# Altium schematic sheet Connector.SchDoc
size A4
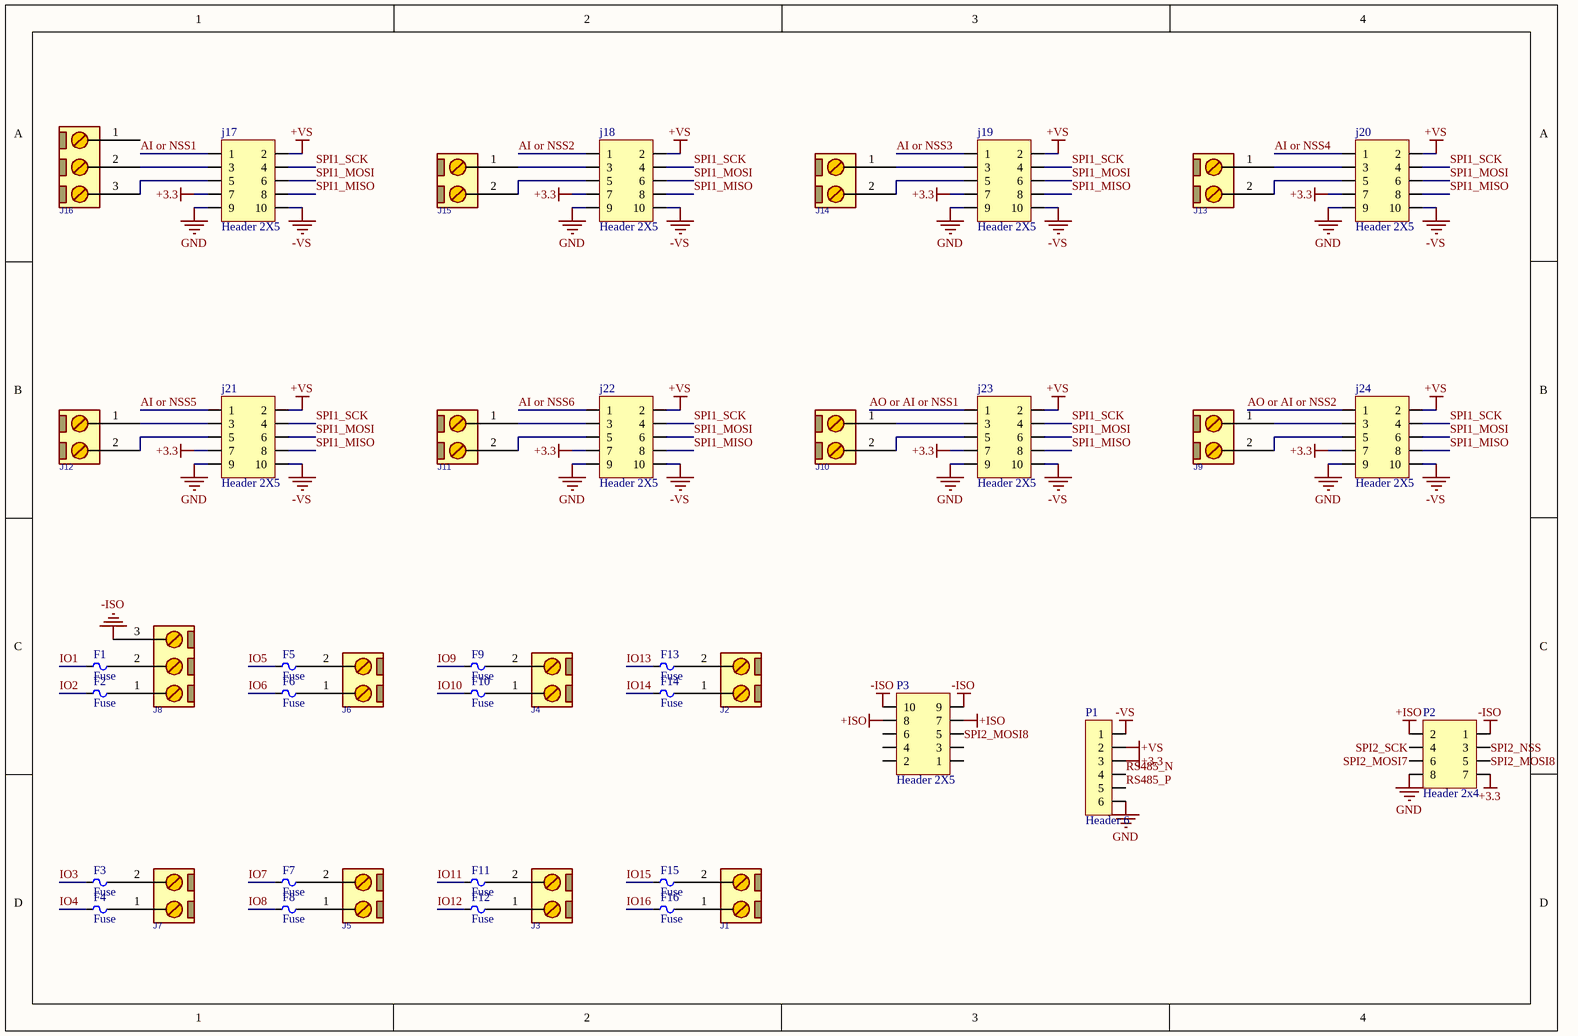
[diagram p0: Connector.SchDoc]

## Parts
F1  Fuse  [Fuse 0805]
F2  Fuse  [Fuse 0805]
F3  Fuse  [Fuse 0805]
F4  Fuse  [Fuse 0805]
F5  Fuse  [Fuse 0805]
F6  Fuse  [Fuse 0805]
F7  Fuse  [Fuse 0805]
F8  Fuse  [Fuse 0805]
F9  Fuse  [Fuse 0805]
F10  Fuse  [Fuse 0805]
F11  Fuse  [Fuse 0805]
F12  Fuse  [Fuse 0805]
F13  Fuse  [Fuse 0805]
F14  Fuse  [Fuse 0805]
F15  Fuse  [Fuse 0805]
F16  Fuse  [Fuse 0805]
J1  CONN_TB2  [TBG_2]  (value not drawn)
J2  CONN_TB2  [TBG_2]  (value not drawn)
J3  CONN_TB2  [TBG_2]  (value not drawn)
J4  CONN_TB2  [TBG_2]  (value not drawn)
J5  CONN_TB2  [TBG_2]  (value not drawn)
J6  CONN_TB2  [TBG_2]  (value not drawn)
J7  CONN_TB2  [TBG_2]  (value not drawn)
J8  CONN_TB3  [TBG_3]  (value not drawn)
J9  CONN_TB2  [TBG_2]  (value not drawn)
J10  CONN_TB2  [TBG_2]  (value not drawn)
J11  CONN_TB2  [TBG_2]  (value not drawn)
J12  CONN_TB2  [TBG_2]  (value not drawn)
J13  CONN_TB2  [TBG_2]  (value not drawn)
J14  CONN_TB2  [TBG_2]  (value not drawn)
J15  CONN_TB2  [TBG_2]  (value not drawn)
J16  CONN_TB3  [TBG_3]  (value not drawn)
j17  Header 2X5  [HDR2_F_2X5]
j18  Header 2X5  [HDR2_F_2X5]
j19  Header 2X5  [HDR2_F_2X5]
j20  Header 2X5  [HDR2_F_2X5]
j21  Header 2X5  [HDR2_F_2X5]
j22  Header 2X5  [HDR2_F_2X5]
j23  Header 2X5  [HDR2_F_2X5]
j24  Header 2X5  [HDR2_F_2X5]
P1  Header 6  [Header 6]
P2  Header 2x4  [HDR 2X4 M ST 2.54]
P3  Header 2X5  [IDC 2X5 M ST 2.54]

## Nets
+3.3: j17.7 j18.7 j19.7 j20.7 j21.7 j22.7 j23.7 j24.7 P1.3 P2.7
+ISO: P2.2 P3.7 P3.8
+VS: j17.2 j18.2 j19.2 j20.2 j21.2 j22.2 j23.2 j24.2 P1.2
-ISO: J8.3 P2.1 P3.9 P3.10
-VS: j17.10 j18.10 j19.10 j20.10 j21.10 j22.10 j23.10 j24.10 P1.1
GND: j17.9 j18.9 j19.9 j20.9 j21.9 j22.9 j23.9 j24.9 P1.6 P2.8
AI or NSS1: j17.1
AI or NSS2: j18.1
AI or NSS3: j19.1
AI or NSS4: j20.1
AI or NSS5: j21.1
AI or NSS6: j22.1
AO or AI or NSS1: j23.1
AO or AI or NSS2: j24.1
IO1: F1.1
IO2: F2.1
IO3: F3.1
IO4: F4.1
IO5: F5.1
IO6: F6.1
IO7: F7.1
IO8: F8.1
IO9: F9.1
IO10: F10.1
IO11: F11.1
IO12: F12.1
IO13: F13.1
IO14: F14.1
IO15: F15.1
IO16: F16.1
RS485_N: P1.4
RS485_P: P1.5
SPI1_MISO: j17.8 j18.8 j19.8 j20.8 j21.8 j22.8 j23.8 j24.8
SPI1_MOSI: j17.6 j18.6 j19.6 j20.6 j21.6 j22.6 j23.6 j24.6
SPI1_SCK: j17.4 j18.4 j19.4 j20.4 j21.4 j22.4 j23.4 j24.4
SPI2_MOSI7: P2.6
SPI2_MOSI8: P2.5 P3.5
SPI2_NSS: P2.3
SPI2_SCK: P2.4
NetF1_2: F1.2 J8.2
NetF2_2: F2.2 J8.1
NetF3_2: F3.2 J7.2
NetF4_2: F4.2 J7.1
NetF5_2: F5.2 J6.2
NetF6_2: F6.2 J6.1
NetF7_2: F7.2 J5.2
NetF8_2: F8.2 J5.1
NetF9_2: F9.2 J4.2
NetF10_2: F10.2 J4.1
NetF11_2: F11.2 J3.2
NetF12_2: F12.2 J3.1
NetF13_2: F13.2 J2.2
NetF14_2: F14.2 J2.1
NetF15_2: F15.2 J1.2
NetF16_2: F16.2 J1.1
NetJ9_1: J9.1 j24.3
NetJ9_2: J9.2 j24.5
NetJ10_1: J10.1 j23.3
NetJ10_2: J10.2 j23.5
NetJ11_1: J11.1 j22.3
NetJ11_2: J11.2 j22.5
NetJ12_1: J12.1 j21.3
NetJ12_2: J12.2 j21.5
NetJ13_1: J13.1 j20.3
NetJ13_2: J13.2 j20.5
NetJ14_1: J14.1 j19.3
NetJ14_2: J14.2 j19.5
NetJ15_1: J15.1 j18.3
NetJ15_2: J15.2 j18.5
NetJ16_2: J16.2 j17.3
NetJ16_3: J16.3 j17.5

Not connected (* = marked no-connect by the designer): J16 1; P3 1 2 3 4 6

## Library data of the parts
J1-J7 J9-J15 = CONN_TB2: CONN, TERMINAL BLOCK, 5.08mm pitch; VALUE: CONN_TB2
J8 J16 = CONN_TB3: CONN, TERMINAL BLOCK, 5.08mm pitch; VALUE: CONN_TB3